# Altium schematic sheet main.SchDoc: Main
size A4; Revision: 1; SheetNumber: 1; SheetTotal: 2
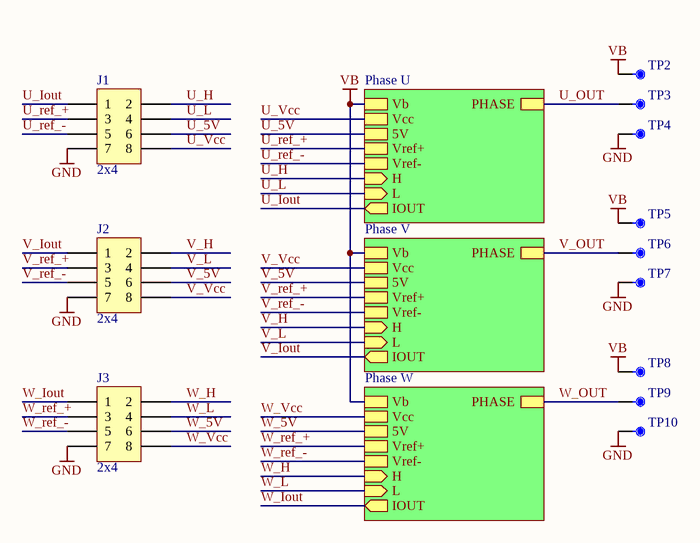
[diagram p0: main.SchDoc]

## Parts
J1  2x4  [HDR-SMD_8P-P2.54-V-M-R2-C4-LS8.0]
J2  2x4  [HDR-SMD_8P-P2.54-V-M-R2-C4-LS8.0]
J3  2x4  [HDR-SMD_8P-P2.54-V-M-R2-C4-LS8.0]
TP2  (no value)  [TP2030_SMD]  (no BOM)
TP3  (no value)  [TP2030_SMD]  (no BOM)
TP4  (no value)  [TP2030_SMD]  (no BOM)
TP5  (no value)  [TP2030_SMD]  (no BOM)
TP6  (no value)  [TP2030_SMD]  (no BOM)
TP7  (no value)  [TP2030_SMD]  (no BOM)
TP8  (no value)  [TP2030_SMD]  (no BOM)
TP9  (no value)  [TP2030_SMD]  (no BOM)
TP10  (no value)  [TP2030_SMD]  (no BOM)

## Sub-sheets
Phase U = power_phase.schdoc: PHASE, Vb, Vcc, IOUT (out), H (in), L (in), Vref+, Vref-, 5V
Phase V = power_phase.schdoc: PHASE, Vb, Vcc, IOUT (out), H (in), L (in), Vref+, Vref-, 5V
Phase W = power_phase.schdoc: PHASE, Vb, Vcc, IOUT (out), H (in), L (in), Vref+, Vref-, 5V

## Nets
GND: J1.7 J2.7 J3.7 TP4.1 TP7.1 TP10.1
VB: TP2.1 TP5.1 TP8.1 ; sheet Phase U/Vb, sheet Phase V/Vb, sheet Phase W/Vb
U_5V: J1.6 ; sheet Phase U/5V
U_H: J1.2 ; sheet Phase U/H
U_Iout: J1.1 ; sheet Phase U/IOUT
U_L: J1.4 ; sheet Phase U/L
U_OUT: TP3.1 ; sheet Phase U/PHASE
U_ref_+: J1.3 ; sheet Phase U/Vref+
U_ref_-: J1.5 ; sheet Phase U/Vref-
U_Vcc: J1.8 ; sheet Phase U/Vcc
V_5V: J2.6 ; sheet Phase V/5V
V_H: J2.2 ; sheet Phase V/H
V_Iout: J2.1 ; sheet Phase V/IOUT
V_L: J2.4 ; sheet Phase V/L
V_OUT: TP6.1 ; sheet Phase V/PHASE
V_ref_+: J2.3 ; sheet Phase V/Vref+
V_ref_-: J2.5 ; sheet Phase V/Vref-
V_Vcc: J2.8 ; sheet Phase V/Vcc
W_5V: J3.6 ; sheet Phase W/5V
W_H: J3.2 ; sheet Phase W/H
W_Iout: J3.1 ; sheet Phase W/IOUT
W_L: J3.4 ; sheet Phase W/L
W_OUT: TP9.1 ; sheet Phase W/PHASE
W_ref_+: J3.3 ; sheet Phase W/Vref+
W_ref_-: J3.5 ; sheet Phase W/Vref-
W_Vcc: J3.8 ; sheet Phase W/Vcc

## Library data of the parts
J1-J3 = Header 8: 2x4 2.54mm PH-00668
TP2-TP10 = TP_Dup1